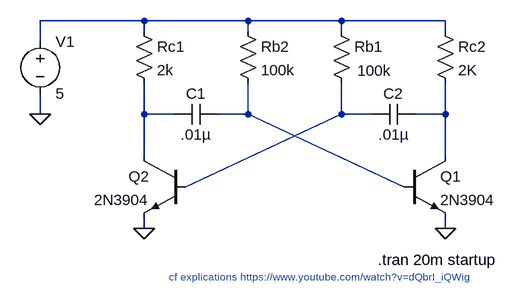
[diagram p0: schematic astable2.asc]
astable2.asc, the LTspice schematic file:
Version 4
SHEET 1 880 680
WIRE -32 0 -192 0
WIRE 128 0 -32 0
WIRE 272 0 128 0
WIRE 432 0 272 0
WIRE -32 16 -32 0
WIRE 128 16 128 0
WIRE 272 16 272 0
WIRE 432 16 432 0
WIRE -192 32 -192 0
WIRE -192 144 -192 112
WIRE -32 144 -32 96
WIRE 16 144 -32 144
WIRE 128 144 128 96
WIRE 128 144 80 144
WIRE 272 144 272 96
WIRE 320 144 272 144
WIRE 432 144 432 96
WIRE 432 144 384 144
WIRE -32 208 -32 144
WIRE 432 208 432 144
WIRE 32 256 272 144
WIRE 368 256 128 144
WIRE -32 320 -32 304
WIRE 432 320 432 304
FLAG 432 320 0
FLAG -32 320 0
FLAG -192 144 0
SYMBOL RES -48 0 R0
SYMATTR InstName Rc1
SYMATTR Value 2k
SYMBOL res 416 0 R0
SYMATTR InstName Rc2
SYMATTR Value 2K
SYMBOL res 112 0 R0
SYMATTR InstName Rb2
SYMATTR Value 100k
SYMBOL res 256 0 R0
WINDOW 3 40 77 Left 2
SYMATTR Value 100k
SYMATTR InstName Rb1
SYMBOL cap 80 128 R90
WINDOW 0 0 32 VBottom 2
WINDOW 3 32 32 VTop 2
SYMATTR InstName C1
SYMATTR Value .01µ
SYMBOL cap 384 128 R90
WINDOW 0 0 32 VBottom 2
WINDOW 3 32 32 VTop 2
SYMATTR InstName C2
SYMATTR Value .01µ
SYMBOL VOLTAGE -192 16 R0
SYMATTR InstName V1
SYMATTR Value 5
SYMBOL NPN 368 208 R0
SYMATTR InstName Q1
SYMATTR Value 2N3904
SYMBOL npn 32 208 M0
SYMATTR InstName Q2
SYMATTR Value 2N3904
TEXT 328 368 Left 2 !.tran 20m startup
TEXT 232 384 Top 1 ;cf explications https://www.youtube.com/watch?v=dQbrI_iQWig

The netlist it stands for:
* astable2.asc
Rc1 N001 N002 2k
Rc2 N001 N005 2K
Rb2 N001 N003 100k
Rb1 N001 N004 100k
C1 N003 N002 .01µ
C2 N005 N004 .01µ
V1 N001 0 5
Q1 N005 N003 0 0 2N3904
Q2 N002 N004 0 0 2N3904
.model NPN NPN
.model PNP PNP
.lib standard.bjt
.tran 20m startup
* cf explications https://www.youtube.com/watch?v=dQbrI_iQWig
.backanno
.end